# Altium schematic sheet ESP32 MCU.SchDoc: Title
size A4; Date: *******; ApprovedBy: *******; CheckedBy: None; Author: *******; CompanyName: *******; DrawnBy: Name; Engineer: *******; Organization: *******; Address1: *******; Address2: *******; Address3: *******; Address4: *******; DocumentNumber: 1; Revision: *******; SheetNumber: 1; SheetTotal: 3; CurrentTime: *******; CurrentDate: *******; Time: *******; DocumentFullPathAndName: *******; DocumentName: *******; ModifiedDate: *******; ImagePath: *******; ProjectName: *******; Application_BuildNumber: *******
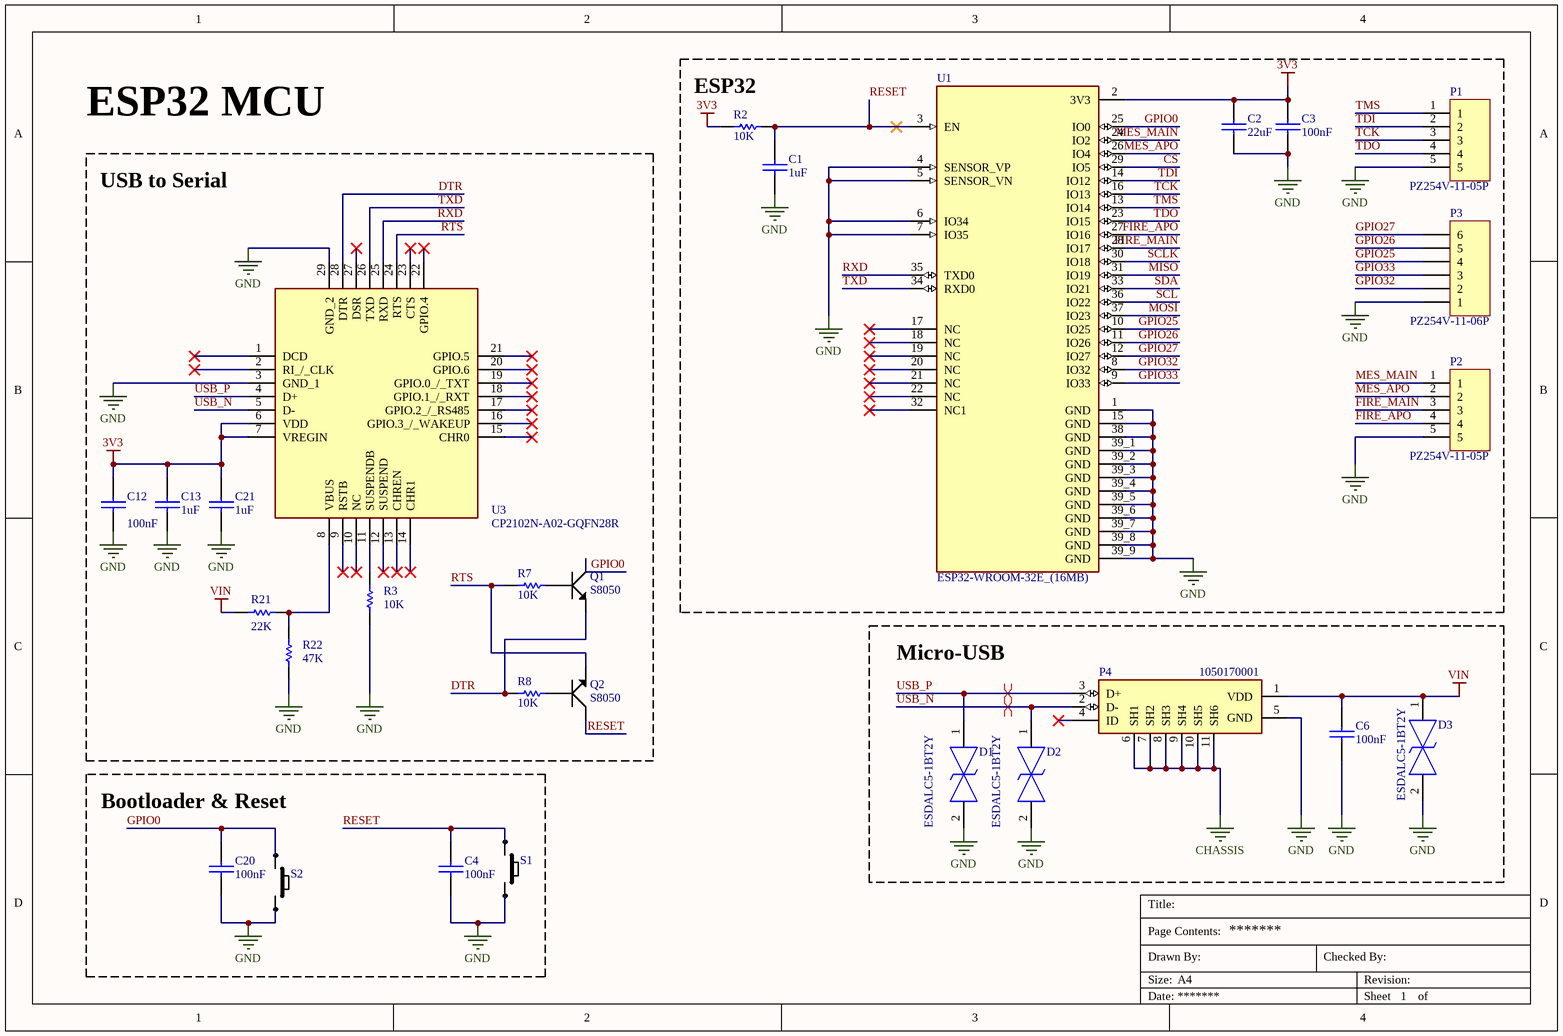
[diagram p0: ESP32 MCU.SchDoc]

## Parts
C1  value 1uF  [CAPSMD0805]
C2  value 22uF  [CAPSMD0805]
C3  value 100nF  [CAPSMD0805]
C4  value 100nF  [CAPSMD0805]
C6  value 100nF  [CAPSMD0805]
C12  value 100nF  [CAPSMD0805]
C13  value 1uF  [CAPSMD0805]
C20  value 100nF  [CAPSMD0805]
C21  value 1uF  [CAPSMD0805]
D1  Manufacturer Part Number: ESDALC5-1BT2Y  [ESDALC51BT2]
D2  Manufacturer Part Number: ESDALC5-1BT2Y  [ESDALC51BT2]
D3  Manufacturer Part Number: ESDALC5-1BT2Y  [ESDALC51BT2]
P1  HEADER-5P-SR  [PZ254V-11-05P]  (value not drawn)
P2  HEADER-5P-SR  [PZ254V-11-05P]  (value not drawn)
P3  Manufacturer Part Number: PZ254V-11-06P  [HDR1X6]
P4  Manufacturer Part Number: 1050170001  [Micro-B Molex 1051640001]
Q1  S8050  [SOT-23-3]
Q2  S8050  [SOT-23-3]
R2  value 10K  [0805]
R3  value 10K  [0805]
R7  value 10K  [0805]
R8  value 10K  [0805]
R21  value 22K  [0805]
R22  value 47K  [0805]
S1  RESET  [PUSHBUTTON_2]  (value not drawn)
S2  BOOT  [PUSHBUTTON_2]  (value not drawn)
U1  ESP32-WROOM-32E_(16MB)  [XCVR_ESP32-WROOM-32E_(16MB)]
U3  (no value)  [CP2102N]

## Blocks framed on the sheet
ESP32: C1-C3 P1-P3 R2 U1
USB to Serial: C12 C13 C21 Q1 Q2 R3 R7 R8 R21 R22 U3
Micro-USB: C6 D1-D3 P4
Bootloader & Reset: C4 C20 S1 S2

## Nets
3V3: C2.1 C3.2 C12.2 C13.1 C21.1 R2.1 U1.2(3V3) U3.6(VDD) U3.7(VREGIN)
CHASSIS: P4.6(SH1) P4.7(SH2) P4.8(SH3) P4.9(SH4) P4.10(SH5) P4.11(SH6)
GND: C1.2 C2.2 C3.1 C4.1 C6.1 C12.1 C13.2 C20.1 C21.2 D1.2 D2.2 D3.2 P1.5 P2.5 P3.1 P4.5(GND) R3.2 R22.1 S1.2 S2.2 U1.1(GND) U1.4(SENSOR_VP) U1.5(SENSOR_VN) U1.6(IO34) U1.7(IO35) U1.15(GND) U1.38(GND) U1.39_1(GND) U1.39_2(GND) U1.39_3(GND) U1.39_4(GND) U1.39_5(GND) U1.39_6(GND) U1.39_7(GND) U1.39_8(GND) U1.39_9(GND) U3.3(GND_1) U3.29(GND_2)
VIN: C6.2 D3.1 P4.1(VDD) R21.1
CS: U1.29(IO5)
DTR: Q1.2 R8.1 U3.28(DTR)
FIRE_APO: P2.4 U1.27(IO16)
FIRE_MAIN: P2.3 U1.28(IO17)
GPIO0: C20.2 Q1.3 S2.1 U1.25(IO0)
GPIO25: P3.4 U1.10(IO25)
GPIO26: P3.5 U1.11(IO26)
GPIO27: P3.6 U1.12(IO27)
GPIO32: P3.2 U1.8(IO32)
GPIO33: P3.3 U1.9(IO33)
MES_APO: P2.2 U1.26(IO4)
MES_MAIN: P2.1 U1.24(IO2)
MISO: U1.31(IO19)
MOSI: U1.37(IO23)
RESET: C1.1 C4.2 Q2.3 R2.2 S1.1 U1.3(EN)
RTS: Q2.2 R7.1 U3.24(RTS)
RXD: U1.35(TXD0) U3.25(RXD)
SCL: U1.36(IO22)
SCLK: U1.30(IO18)
SDA: U1.33(IO21)
TCK: P1.3 U1.16(IO13)
TDI: P1.2 U1.14(IO12)
TDO: P1.4 U1.23(IO15)
TMS: P1.1 U1.13(IO14)
TXD: U1.34(RXD0) U3.26(TXD)
USB_N: D2.1 P4.2(D-) U3.5(D-)
USB_P: D1.1 P4.3(D+) U3.4(D+)
NetQ1_1: Q1.1 R7.2
NetQ2_1: Q2.1 R8.2
NetR3_1: R3.1 U3.11(SUSPENDB)
NetR21_2: R21.2 R22.2 U3.8(VBUS)

Not connected (* = marked no-connect by the designer): P4 4(ID)*; U1 17(NC)* 18(NC)* 19(NC)* 20(NC)* 21(NC)* 22(NC)* 32(NC1)*; U3 1(DCD)* 2(RI_/_CLK)* 9(RSTB)* 10(NC)* 12(SUSPEND)* 13(CHREN)* 14(CHR1)* 15(CHR0)* 16(GPIO.3_/_WAKEUP)* 17(GPIO.2_/_RS485)* 18(GPIO.1_/_RXT)* 19(GPIO.0_/_TXT)* 20(GPIO.6)* 21(GPIO.5)* 22(GPIO.4)* 23(CTS)* 27(DSR)*

## Layout directives
differential pair; differential pair class USB: USB_N, USB_P

## Notes on the sheet
- ESP32 MCU
- Title:
- Size:
- Date:
- Drawn By:
- Page Contents:
- A4
- Checked By:
- Revision:
- Sheet
- of

## Library data of the parts
C1 C13 C21 = CAP: Capacitor SMD 4.7nF; Manufacturer: FH (Guangdong Fenghua Advanced Tech); Manufacturer Part Number: 0805F105Z250NT; Supplier: JLCPCB; Supplier Part Number: C285184
C2 = CAP: Capacitor SMD 4.7nF; Manufacturer: Samsung Electro-Mechanics; Manufacturer Part Number: CL21A226KPCLRNC; Supplier: JLCPCB; Supplier Part Number: C318688
C3 C4 C6 C12 C20 = CAP: Capacitor SMD 4.7nF; Manufacturer: FH (Guangdong Fenghua Advanced Tech); Manufacturer Part Number: 0805B104M500NT; Supplier: JLCPCB; Supplier Part Number: C286511
D1-D3 = ESDALC5-1BT2: ESD Suppressors / TVS Diodes Single Line Transil Vbr 5V min 26pF 0; Manufacturer: STMicroelectronics; Supplier: JLCPCB; Supplier Part Number: C3712112
P1 P2 = HEADER-5P-SR: Straight Square Pins 2.5mm 6mm -40℃~+105℃ 3mm 5 2.54mm 单排 Black Brass 1x5P Plugin,P=2.54mm  Pin Headers ROHS; Manufacturer: XFCN; Supplier: JLCPCB; Supplier Part Number: C492404; Manufacturer Part Number: PZ254V-11-05P
P3 = Header 6: Header, 6-Pin; Manufacturer: XFCN; Supplier: JLCPCB; Supplier Part Number: C492405
P4 = Micro-B Molex 1051640001: USB - micro B USB 2.0 Receptacle Connector 5 Position Surface Mount, Right Angle; Through Hole; Manufacturer: MOLEX; Supplier: JLCPCB; Supplier Part Number: C136000
Q1 Q2 = S8050: 25V 300mW 500mA SOT-23  Bipolar Transistors - BJT ROHS; Manufacturer: JSMSEMI; Supplier: JLCPCB; Supplier Part Number: C916390; Manufacturer Part Number: S8050
R2 R3 R7 R8 = RES: Resistencia SMD 470ohms; Manufacturer: Viking Tech; Manufacturer Part Number: ARG05BTC1002; Supplier: JLCPCB; Supplier Part Number: C406725
R21 = RES: Resistencia SMD 470ohms; Manufacturer: KOA Speer Elec; Manufacturer Part Number: RN73H2ATTD2202B25; Supplier: JLCPCB; Supplier Part Number: C186285
R22 = RES: Resistencia SMD 470ohms; Manufacturer: Sunway; Manufacturer Part Number: SC0805J4702F4ANRH; Supplier: JLCPCB; Supplier Part Number: C3152235
S1 S2 = PUSHBUTTON_2: SWITCH TACTILE SPST-NO 0.05A 12V; Manufacturer: C&K; Manufacturer Part Number: PTS645SM43SMTR92LFS; Supplier: JLCPCB; Supplier Part Number: C221880; Parameter 2: *; Parameter 3: *; Parameter 4: *
U1 = ESP32-WROOM-32E_(16MB): Bluetooth, WiFi 802.11b/g/n, Bluetooth v4.2 +EDR, Class 1, 2 and 3 Transceiver Module 2.4GHz ~ 2.5GHz Integrated, Trace Surface Mount; Manufacturer: Espressif Systems; Manufacturer Part Number: ESP32-WROOM-32E-N16; Supplier: JLCPCB; Supplier Part Number: C701343
U3 = CP2102N-A02-GQFN28R: USB Interface IC USB to UART bridge - QFN28; Manufacturer: SILICON LABS; Manufacturer Part Number: CP2102N-A02-GQFN28R; Supplier: JLCPCB; Supplier Part Number: C964632